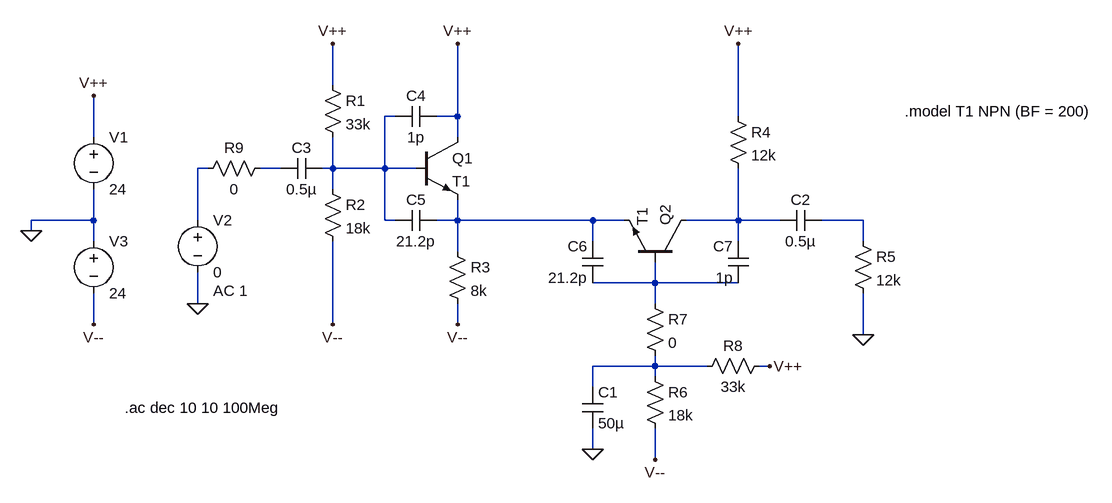
[diagram p0: schematic Ej#3_c.asc]
Ej#3_c.asc, the LTspice schematic file:
Version 4
SHEET 1 972 712
WIRE -224 32 -224 -32
WIRE -128 80 -144 80
WIRE -32 80 -32 -32
WIRE -32 80 -64 80
WIRE 400 80 400 -32
WIRE -592 112 -592 48
WIRE -32 112 -32 80
WIRE -416 160 -432 160
WIRE -304 160 -336 160
WIRE -224 160 -224 112
WIRE -224 160 -240 160
WIRE -144 160 -144 80
WIRE -144 160 -224 160
WIRE -96 160 -144 160
WIRE -224 192 -224 160
WIRE -592 240 -592 192
WIRE -592 240 -688 240
WIRE -432 240 -432 160
WIRE -144 240 -144 160
WIRE -128 240 -144 240
WIRE -32 240 -32 208
WIRE -32 240 -64 240
WIRE 176 240 -32 240
WIRE 224 240 176 240
WIRE 400 240 400 160
WIRE 400 240 320 240
WIRE 464 240 400 240
WIRE 592 240 528 240
WIRE -688 256 -688 240
WIRE -592 272 -592 240
WIRE 176 272 176 240
WIRE 400 272 400 240
WIRE 592 272 592 240
WIRE -32 288 -32 240
WIRE 272 336 272 304
WIRE 272 336 176 336
WIRE 400 336 272 336
WIRE -432 368 -432 320
WIRE 272 368 272 336
WIRE -592 400 -592 352
WIRE -224 400 -224 272
WIRE -32 400 -32 368
WIRE 592 416 592 352
WIRE 272 464 272 448
WIRE 272 464 176 464
WIRE 352 464 272 464
WIRE 448 464 432 464
WIRE 272 480 272 464
WIRE 176 496 176 464
WIRE 176 592 176 560
WIRE 272 608 272 560
FLAG 592 416 0
FLAG -432 368 0
FLAG -688 256 0
FLAG 176 592 0
FLAG -592 48 V++
FLAG -592 400 V--
FLAG -224 400 V--
FLAG -32 400 V--
FLAG 272 608 V--
FLAG -224 -32 V++
FLAG -32 -32 V++
FLAG 400 -32 V++
FLAG 448 464 V++
SYMBOL npn -96 112 R0
SYMATTR InstName Q1
SYMATTR Value T1
SYMBOL npn 320 304 M270
SYMATTR InstName Q2
SYMATTR Value T1
SYMBOL voltage -592 96 R0
WINDOW 123 0 0 Left 0
WINDOW 39 0 0 Left 0
SYMATTR InstName V1
SYMATTR Value 24
SYMBOL res -240 16 R0
SYMATTR InstName R1
SYMATTR Value 33k
SYMBOL res -240 176 R0
SYMATTR InstName R2
SYMATTR Value 18k
SYMBOL res -48 272 R0
SYMATTR InstName R3
SYMATTR Value 8k
SYMBOL res 384 64 R0
SYMATTR InstName R4
SYMATTR Value 12k
SYMBOL res 576 256 R0
SYMATTR InstName R5
SYMATTR Value 12k
SYMBOL res 256 464 R0
SYMATTR InstName R6
SYMATTR Value 18k
SYMBOL cap 160 496 R0
SYMATTR InstName C1
SYMATTR Value 50µ
SYMBOL res 256 352 R0
SYMATTR InstName R7
SYMATTR Value 0
SYMBOL cap 528 224 R90
WINDOW 0 0 32 VBottom 2
WINDOW 3 32 32 VTop 2
SYMATTR InstName C2
SYMATTR Value 0.5µ
SYMBOL voltage -432 224 R0
WINDOW 123 24 124 Left 2
WINDOW 39 0 0 Left 0
SYMATTR InstName V2
SYMATTR Value 0
SYMATTR Value2 AC 1
SYMBOL voltage -592 256 R0
WINDOW 123 0 0 Left 0
WINDOW 39 0 0 Left 0
SYMATTR InstName V3
SYMATTR Value 24
SYMBOL res 448 448 R90
WINDOW 0 0 56 VBottom 2
WINDOW 3 32 56 VTop 2
SYMATTR InstName R8
SYMATTR Value 33k
SYMBOL cap -64 64 R90
WINDOW 0 0 32 VBottom 2
WINDOW 3 32 32 VTop 2
SYMATTR InstName C4
SYMATTR Value 1p
SYMBOL cap -64 224 R90
WINDOW 0 0 32 VBottom 2
WINDOW 3 32 32 VTop 2
SYMATTR InstName C5
SYMATTR Value 21.2p
SYMBOL cap 192 336 R180
WINDOW 0 24 56 Left 2
WINDOW 3 24 8 Left 2
SYMATTR InstName C6
SYMATTR Value 21.2p
SYMBOL cap 416 336 R180
WINDOW 0 24 56 Left 2
WINDOW 3 24 8 Left 2
SYMATTR InstName C7
SYMATTR Value 1p
SYMBOL res -320 144 R90
WINDOW 0 0 56 VBottom 2
WINDOW 3 32 56 VTop 2
SYMATTR InstName R9
SYMATTR Value 0
SYMBOL cap -240 144 R90
WINDOW 0 0 32 VBottom 2
WINDOW 3 32 32 VTop 2
SYMATTR InstName C3
SYMATTR Value 0.5µ
TEXT 656 72 Left 2 !.model T1 NPN (BF = 200)
TEXT -544 528 Left 2 !.ac dec 10 10 100Meg

The netlist it stands for:
* Ej#3_c.asc
Q1 V++ N001 N004 0 T1
Q2 N005 N007 N004 0 T1
V1 V++ 0 24
R1 V++ N001 33k
R2 N001 V-- 18k
R3 N004 V-- 8k
R4 V++ N005 12k
R5 N006 0 12k
R6 N008 V-- 18k
C1 N008 0 50µ
R7 N007 N008 0
C2 N006 N005 0.5µ
V2 N002 0 0 AC 1
V3 0 V-- 24
R8 V++ N008 33k
C4 V++ N001 1p
C5 N004 N001 21.2p
C6 N007 N004 21.2p
C7 N007 N005 1p
R9 N003 N002 0
C3 N001 N003 0.5µ
.model NPN NPN
.model PNP PNP
.lib standard.bjt
.model T1 NPN (BF = 200)
.ac dec 10 10 100Meg
.backanno
.end